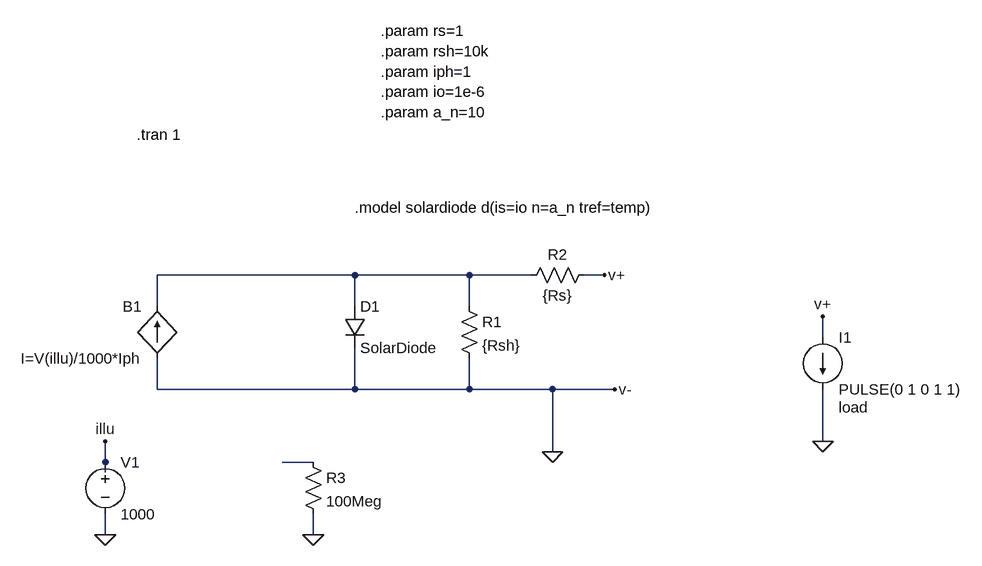
[diagram p0: schematic Solar Panel LT Spice Simulation.asc]
Solar Panel LT Spice Simulation.asc, the LTspice schematic file:
Version 4.1
SHEET 1 1176 680
WIRE 176 80 -128 80
WIRE 352 80 176 80
WIRE 448 80 352 80
WIRE 560 80 528 80
WIRE -128 128 -128 80
WIRE 176 128 176 80
WIRE 352 128 352 80
WIRE 896 176 896 144
WIRE -128 256 -128 208
WIRE 176 256 176 192
WIRE 176 256 -128 256
WIRE 352 256 352 208
WIRE 352 256 176 256
WIRE 480 256 352 256
WIRE 576 256 480 256
WIRE 896 336 896 256
WIRE 480 352 480 256
WIRE -208 368 -208 336
WIRE 112 368 64 368
WIRE -208 384 -208 368
WIRE -208 480 -208 448
WIRE 112 480 112 448
FLAG 112 480 0
FLAG 480 352 0
FLAG 560 80 v+
FLAG 576 256 v-
FLAG 896 144 v+
FLAG 896 336 0
FLAG -208 336 illu
FLAG -208 480 0
SYMBOL diode 160 128 R0
SYMATTR InstName D1
SYMATTR Value SolarDiode
SYMBOL res 336 112 R0
SYMATTR InstName R1
SYMATTR Value {Rsh}
SYMBOL res 544 64 R90
WINDOW 0 0 56 VBottom 2
WINDOW 3 32 56 VTop 2
SYMATTR InstName R2
SYMATTR Value {Rs}
SYMBOL res 96 352 R0
SYMATTR InstName R3
SYMATTR Value 100Meg
SYMBOL current 896 176 R0
WINDOW 123 0 0 Left 0
WINDOW 39 24 108 Left 2
SYMATTR SpiceLine load
SYMATTR InstName I1
SYMATTR Value PULSE(0 1 0 1 1)
SYMBOL voltage -208 352 R0
SYMATTR InstName V1
SYMATTR Value 1000
SYMBOL bi -128 208 R180
WINDOW 0 24 80 Left 2
WINDOW 3 24 0 Left 2
SYMATTR InstName B1
SYMATTR Value I=V(illu)/1000*Iph
TEXT 176 -24 Left 2 !.model solardiode d(is=io n=a_n tref=temp)
TEXT 216 -296 Left 2 !.param rs=1\n.param rsh=10k\n.param iph=1\n.param io=1e-6\n.param a_n=10
TEXT -160 -136 Left 2 !.tran 1

The netlist it stands for:
* Solar Panel LT Spice Simulation.asc
D1 N001 0 SolarDiode
R1 N001 0 {Rsh}
R2 v+ N001 {Rs}
R3 N002 0 100Meg
I1 v+ 0 PULSE(0 1 0 1 1) load
V1 illu 0 1000
B1 0 N001 I=V(illu)/1000*Iph
.model D D
.lib standard.dio
.model solardiode d(is=io n=a_n tref=temp)
.param rs=1
.param rsh=10k
.param iph=1
.param io=1e-6
.param a_n=10
.tran 1
.backanno
.end